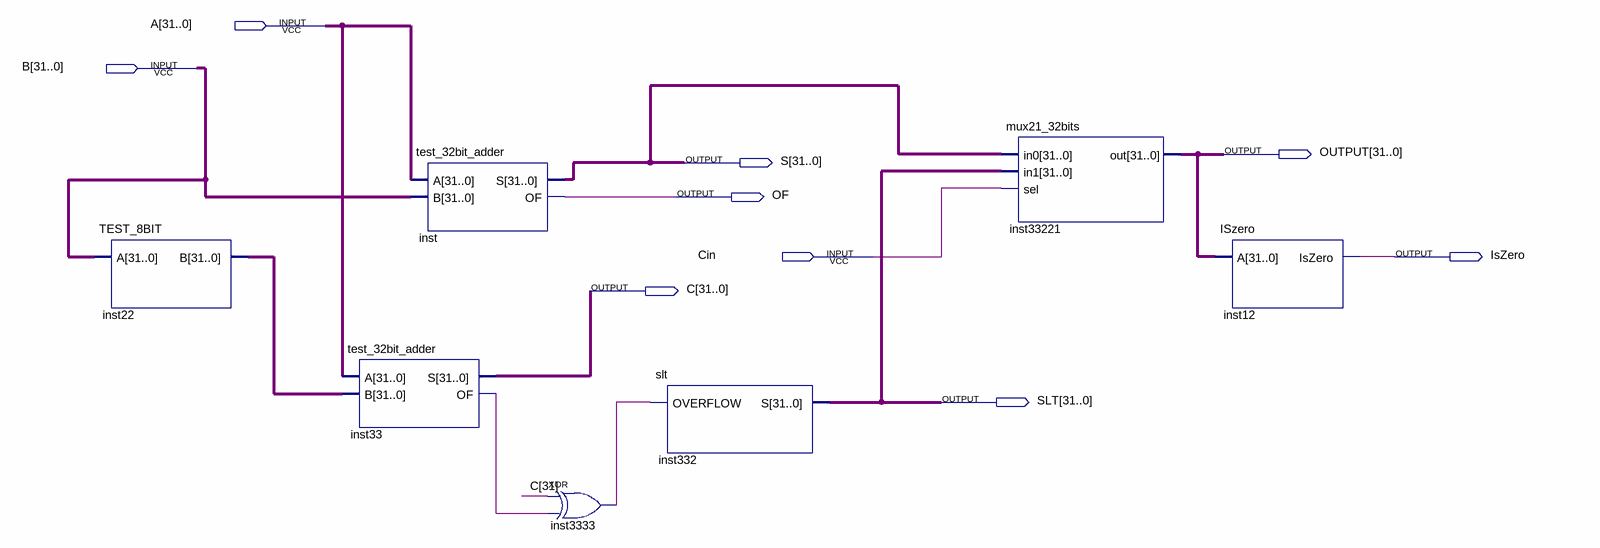
[diagram p0: schematic sheet]
// Quartus schematic testa_b.bdf as structural Verilog: 7 symbols, 9 pins
module testa_b (
  input  [31:0] A,
  input  [31:0] B,
  input  Cin,
  output [31:0] OUTPUT,
  output [31:0] S,
  output OF,
  output IsZero,
  output [31:0] C,
  output [31:0] SLT
);

  wire inst33_of, inst3333_out;
  wire [31:0] inst22_b;

  TEST_8BIT inst22 (.A(B), .B(inst22_b));
  test_32bit_adder inst33 (.A(A), .B(inst22_b), .S(C), .OF(inst33_of));
  test_32bit_adder inst (.A(A), .B(B), .S(S), .OF(OF));
  xor inst3333 (inst3333_out, C[31], inst33_of);
  slt inst332 (.OVERFLOW(inst3333_out), .S(SLT));
  mux21_32bits inst33221 (.in0(S), .in1(SLT), .sel(Cin), .out(OUTPUT));
  ISzero inst12 (.A(OUTPUT), .IsZero(IsZero));
endmodule
